# Altium schematic sheet encoder_motor.SchDoc
size A4; SheetNumber: 3; SheetTotal: 3
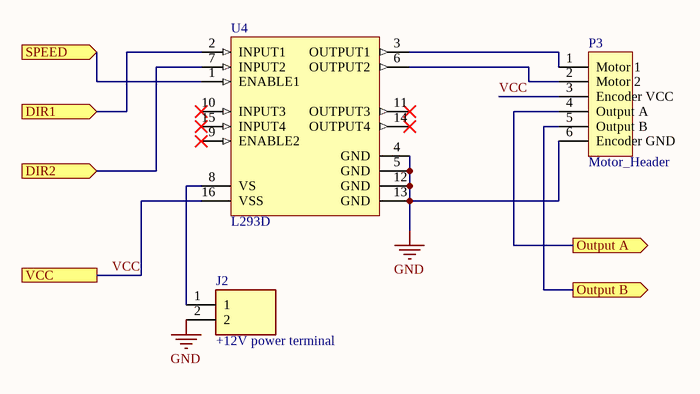
[diagram p0: encoder_motor.SchDoc]

## Parts
J2  +12V power terminal  [screw_terminal]
P3  Motor_Header  [HDR1X6]
U4  L293D  [STM-L293D-16]

## Ports
DIR1 (in), DIR2 (in), Output A (out), Output B (out), SPEED (in), VCC

## Nets
GND: J2.2 P3.6(Encoder_GND) U4.4(GND) U4.5(GND) U4.12(GND) U4.13(GND)
DIR1: U4.2(INPUT1) ; port DIR1
DIR2: U4.7(INPUT2) ; port DIR2
Output A: P3.4(Output_A) ; port Output A
Output B: P3.5(Output_B) ; port Output B
SPEED: U4.1(ENABLE1) ; port SPEED
VCC: P3.3(Encoder_VCC) U4.16(VSS) ; port VCC
NetJ2_1: J2.1 U4.8(VS)
NetP3_1: P3.1(Motor_1) U4.3(OUTPUT1)
NetP3_2: P3.2(Motor_2) U4.6(OUTPUT2)

Not connected (* = marked no-connect by the designer): U4 9(ENABLE2)* 10(INPUT3)* 11(OUTPUT3)* 14(OUTPUT4)* 15(INPUT4)*

## Library data of the parts
J2 = TB002-500-02BE: 2~24 Poles, Screw Type, Horizontal, 5.0 Pitch, 22~12 (AWG), Terminal Block Connector; MF: CUI Devices; Purchase-URL: https://pricing.snapeda.com/search/part/TB002-500-02BE/?ref=eda; MP: TB002-500-02BE; Package: None; Price: None; Availability: In Stock; SnapEDA_Link: https://www.snapeda.com/parts/TB002-500-02BE/CUI+Devices/view-part/?ref=snap; Value: *; Check_prices: https://www.snapeda.com/parts/TB002-500-02BE/CUI+Devices/view-part/?ref=eda; CUI_purchase_URL: https://www.cuidevices.com/product/interconnect/connectors/terminal-blocks/tb002-500-series?utm_source=snapeda.com&utm_medium=referral&utm_campaign=snapedaBOM
P3 = Header 6: Header, 6-Pin; LatestRevisionDate: 17-Jul-2002; LatestRevisionNote: Re-released for DXP Platform.; Publisher: Altium Limited
U4 = CMP-2000-06524-1: Push-Pull Four Channel Driver with Diode, 4.5 to 36 V, -40 to 150 degC, 16-Pin PDIP, RoHS, Tube; Manufacturer: STMicroelectronics; Number of Outputs: 4; Current - Peak Output: 1.2A; Current - Output / Channel: 600mA; Input Type: Non-Inverting; Other Related Documents: L293DViewAllSpecifications; Dynamic Catalog: HalfBridge; Voltage - Supply: 4.5V~36V; Other Names: 497-2936-5; Package / Case: 16-DIP(0.300",7.62mm); PartNumber: L293D; Operating Temperature: -40°C~150°C; Datasheet URL: http://www.st.com/st-web-ui/static/active/en/resource/technical/document/datasheet/CD00000059.pdf; Supplier Device Package: 16-PowerDIP; Packaging: Tube; Package Description: 16-Pin Thru-Hole Dual-In-Line, Body 20 x 6.85 mm, Pitch 2.54 mm; Standard Package: 25; Datasheet Version: 07/2003; On-State Resistance: -; Manufacturer URL: http://www.st.com/; Category: IntegratedCircuits(ICs); Family: PMIC-MOSFET,BridgeDrivers-InternalSwitch; Type: HalfBridge; Series: -; Mounting Technology: ThroughHole; Package Reference: DIP-16; Mounting Type: ThroughHole